# Altium schematic sheet Esp_schm.SchDoc
size A3; SheetNumber: 1; SheetTotal: 1
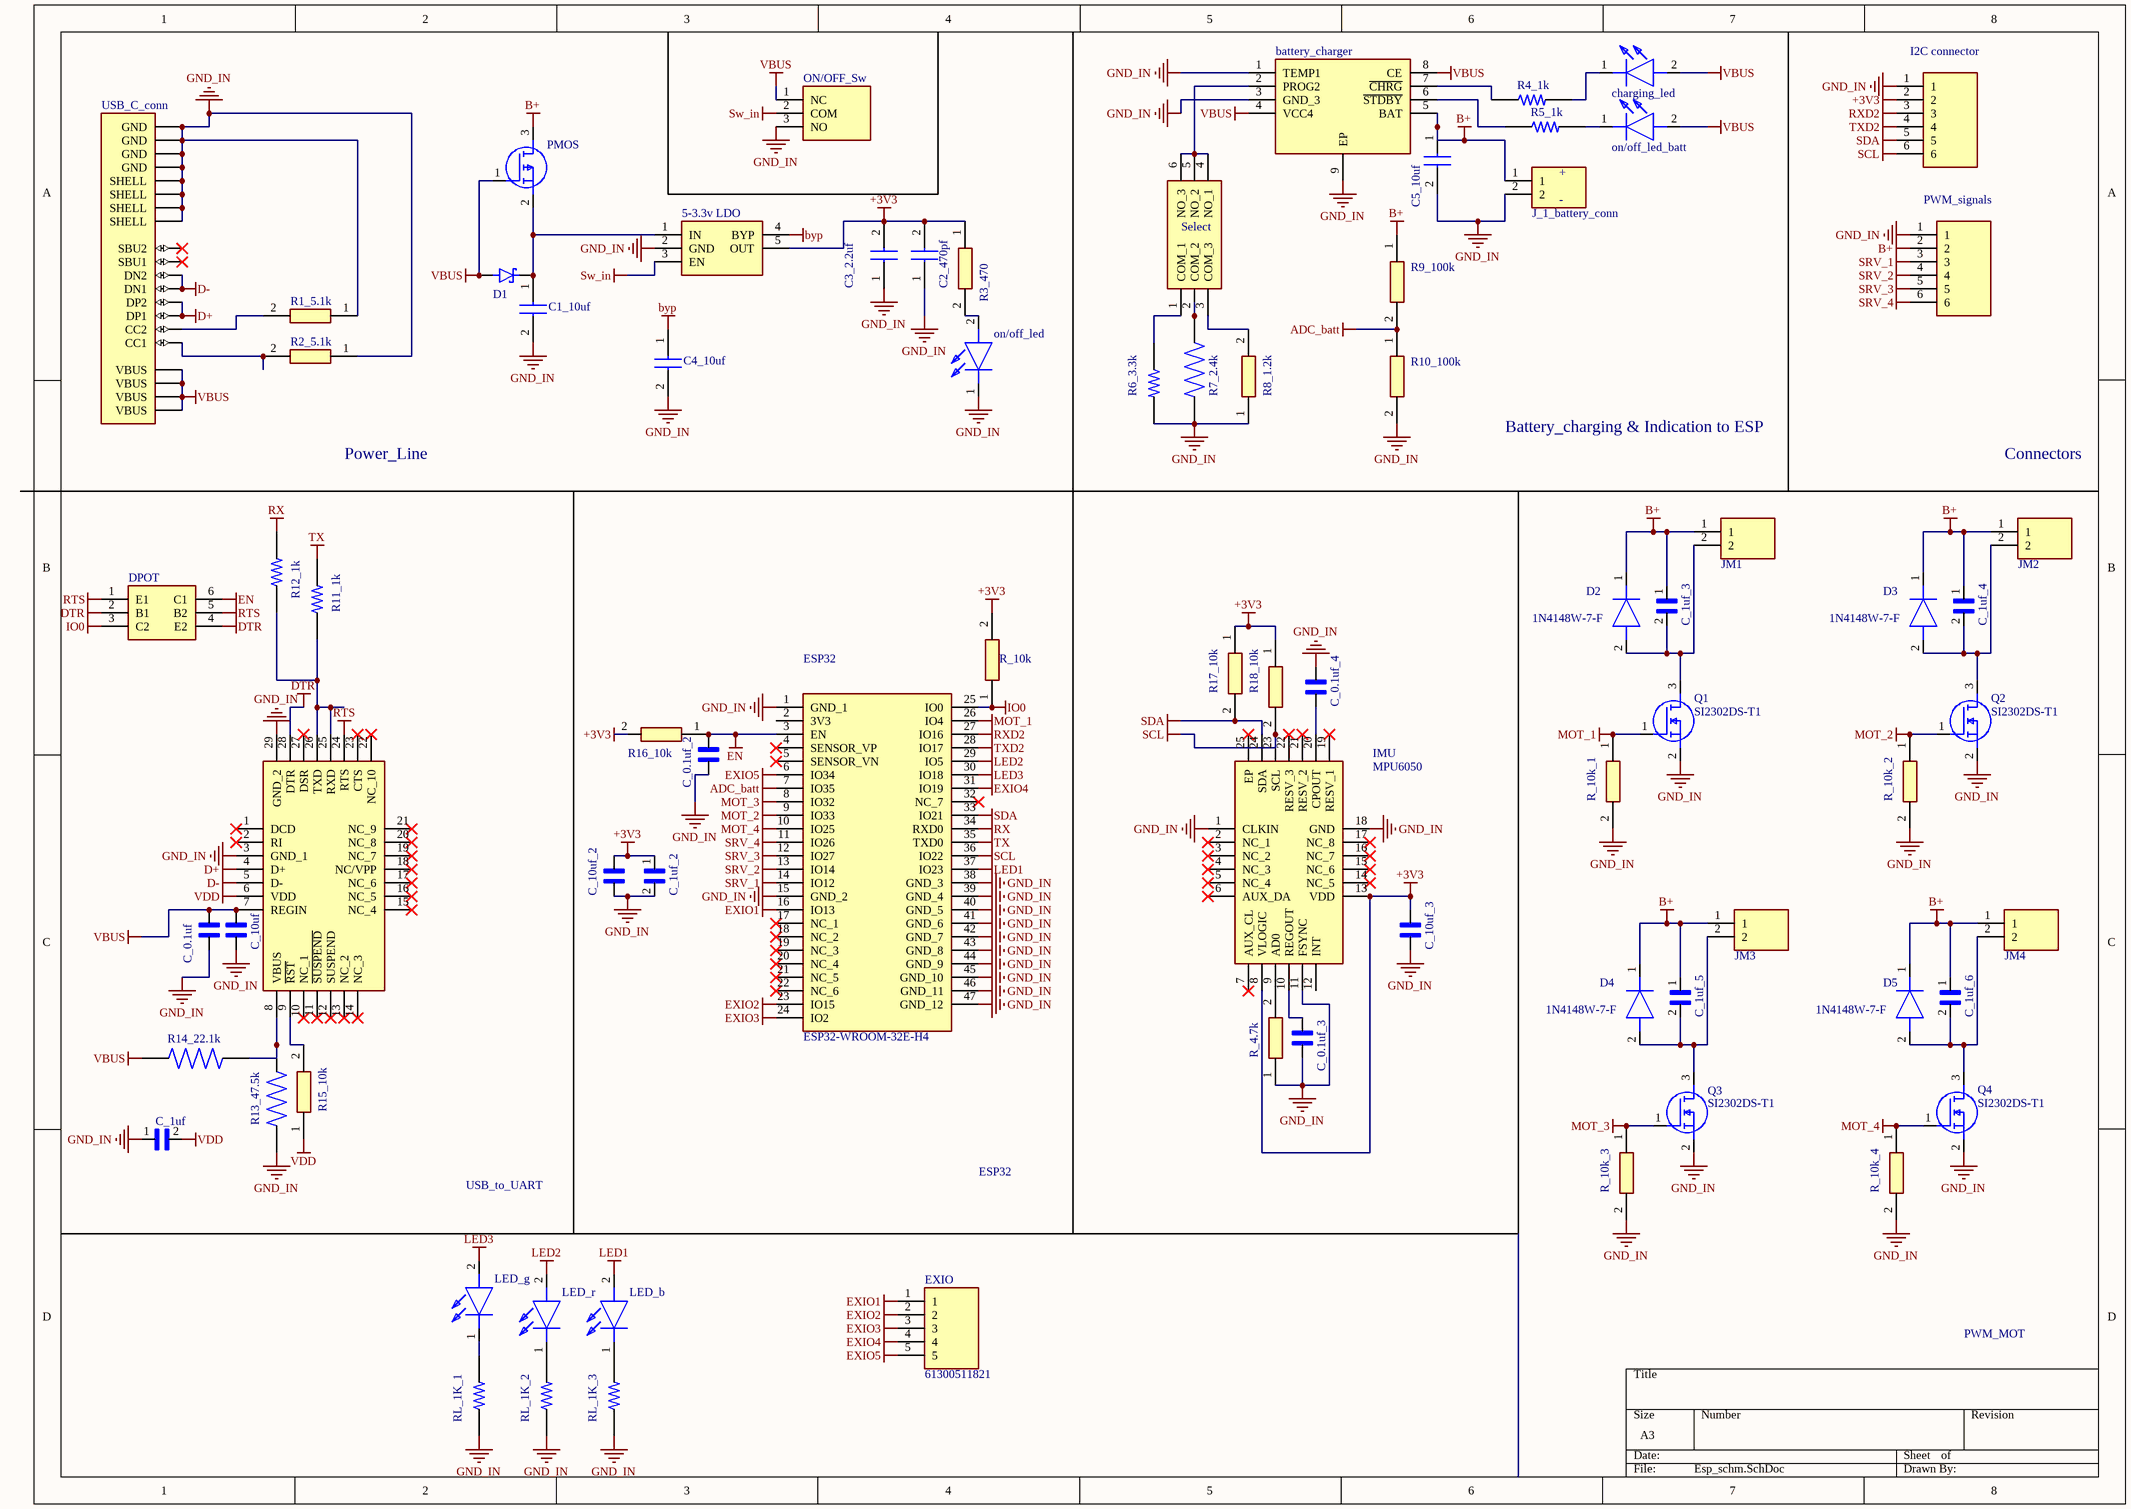
[diagram p0: Esp_schm.SchDoc]

## Parts
5-3.3v_LDO  MIC5219-3.3YM5-TR  [SOT95P280X145-5N]  (value not drawn)
battery_charger  TP4056  [SOIC127P600X175-9N]  (value not drawn)
C1_10uf  CGA3EDX7T1A106M080AU  [CAPC1608X90N]  (value not drawn)
C2_470pf  02015C471KAT2A  [CAPC0603X33N]  (value not drawn)
C3_2.2uf  CL03A225MO5C65C  [CAPC0603X35N]  (value not drawn)
C4_10uf  CGA3EDX7T1A106M080AU  [CAPC1608X90N]  (value not drawn)
C5_10uf  CGA3EDX7T1A106M080AU  [CAPC1608X90N]  (value not drawn)
C_0.1uf  GCM188R71C104KA37J  [CAPC1608X90N]  (value not drawn)
C_0.1uf_2  GCM188R71C104KA37J  [CAPC1608X90N]  (value not drawn)
C_0.1uf_3  GCM188R71C104KA37J  [CAPC1608X90N]  (value not drawn)
C_0.1uf_4  GCM188R71C104KA37J  [CAPC1608X90N]  (value not drawn)
C_1uf  C1608X7R1C105K080AC  [CAPC1608X90N]  (value not drawn)
C_1uf_2  C1608X7R1C105K080AC  [CAPC1608X90N]  (value not drawn)
C_1uf_3  C1608X7R1C105K080AC  [CAPC1608X90N]  (value not drawn)
C_1uf_4  C1608X7R1C105K080AC  [CAPC1608X90N]  (value not drawn)
C_1uf_5  C1608X7R1C105K080AC  [CAPC1608X90N]  (value not drawn)
C_1uf_6  C1608X7R1C105K080AC  [CAPC1608X90N]  (value not drawn)
C_10uf  GRT188R61C106KE13J_1  [CAPC1608X95N]  (value not drawn)
C_10uf_2  GRT188R61C106KE13J_1  [CAPC1608X95N]  (value not drawn)
C_10uf_3  GRT188R61C106KE13J_1  [CAPC1608X95N]  (value not drawn)
charging_led  SML-D12U1WT86  [LEDC1608X65N]  (value not drawn)
D1  SS34  [DIOM7959X265N]  (value not drawn)
D2  1N4148W-7-F  [1N4148W7F]
D3  1N4148W-7-F  [1N4148W7F]
D4  1N4148W-7-F  [1N4148W7F]
D5  1N4148W-7-F  [1N4148W7F]
DPOT  DDC114TU-7-F  [SOT65P210X110-6N]  (value not drawn)
ESP32  ESP32-WROOM-32E-H4  [ESP32WROOM32EH4]
EXIO  61300511821  [61300511821]
I2C_connector  B6B-XH-A_LF__SN_  [SHDR6W64P0X250_1X6_1740X575X700P]  (value not drawn)
IMU  MPU6050  [MPU6050]
J_1_battery_conn  B2B-XH-A_LF__SN_  [SHDR2W64P0X250_1X2_740X575X700P]  (value not drawn)
JM1  B2B-XH-A_LF__SN_  [SHDR2W64P0X250_1X2_740X575X700P]  (value not drawn)
JM2  B2B-XH-A_LF__SN_  [SHDR2W64P0X250_1X2_740X575X700P]  (value not drawn)
JM3  B2B-XH-A_LF__SN_  [SHDR2W64P0X250_1X2_740X575X700P]  (value not drawn)
JM4  B2B-XH-A_LF__SN_  [SHDR2W64P0X250_1X2_740X575X700P]  (value not drawn)
LED_b  150060BS55040  [LEDC1608X50N]  (value not drawn)
LED_g  ASMT-RF45-AN002  [LEDC1608X55N]  (value not drawn)
LED_r  KR_DELPS1.22-VGVI-23-H3Q4  [KRDELPS122VGVI23H3Q4]  (value not drawn)
on/off_led  LB_Q39G-L2OO-35-1  [LEDC1608X40N]  (value not drawn)
on/off_led_batt  LB_Q39G-L2OO-35-1  [LEDC1608X40N]  (value not drawn)
ON/OFF_Sw  SLW-883935-2A-D  [SLW8839352AD]  (value not drawn)
PMOS  AO3401A  [SOT95P280X125-3N]  (value not drawn)
PWM_signals  B6B-XH-A_LF__SN_  [SHDR6W64P0X250_1X6_1740X575X700P]  (value not drawn)
Q1  SI2302DS-T1  [SOT95P237X112-3N]
Q2  SI2302DS-T1  [SOT95P237X112-3N]
Q3  SI2302DS-T1  [SOT95P237X112-3N]
Q4  SI2302DS-T1  [SOT95P237X112-3N]
R1_5.1k  ERA-3VEB5101V  [ERA3KV_(0603)]  (value not drawn)
R2_5.1k  ERA-3VEB5101V  [ERA3KV_(0603)]  (value not drawn)
R3_470  ERJ-1GJF4700C  [ERJ1GJJ2R4C]  (value not drawn)
R4_1k  RC0603FR-071KL  [RESC1607X60N]  (value not drawn)
R5_1k  RC0603FR-071KL  [RESC1607X60N]  (value not drawn)
R6_3.3k  RC0603FR-073K3L  [RESC1607X60N]  (value not drawn)
R7_2.4k  RC0603FR-072K4L  [RESC1607X60N]  (value not drawn)
R8_1.2k  ERJ-3GEYJ122V  [ERJ3EKF1000V]  (value not drawn)
R9_100k  RC0805FR-7W100KL  [RESC2012X60N]  (value not drawn)
R10_100k  RC0805FR-7W100KL  [RESC2012X60N]  (value not drawn)
R11_1k  RC0603FR-071KL  [RESC1607X60N]  (value not drawn)
R12_1k  RC0603FR-071KL  [RESC1607X60N]  (value not drawn)
R13_47.5k  CRCW060347K5FKEA  [RESC1508X50N]  (value not drawn)
R14_22.1k  CRCW060322K1FKEA  [RESC1508X50N]  (value not drawn)
R15_10k  CRCW060310K0FKEA  [RESC1608X50N]  (value not drawn)
R16_10k  CRCW060310K0FKEA  [RESC1608X50N]  (value not drawn)
R17_10k  CRCW060310K0FKEA  [RESC1608X50N]  (value not drawn)
R18_10k  CRCW060310K0FKEA  [RESC1608X50N]  (value not drawn)
R_4.7k  GWCR0603-4K7FT5  [RESC1608X55N]  (value not drawn)
R_10k  CRCW060310K0FKEA  [RESC1608X50N]  (value not drawn)
R_10k_1  CRCW060310K0FKEA  [RESC1608X50N]  (value not drawn)
R_10k_2  CRCW060310K0FKEA  [RESC1608X50N]  (value not drawn)
R_10k_3  CRCW060310K0FKEA  [RESC1608X50N]  (value not drawn)
R_10k_4  CRCW060310K0FKEA  [RESC1608X50N]  (value not drawn)
RL_1K_1  RC0603FR-071KL  [RESC1607X60N]  (value not drawn)
RL_1K_2  RC0603FR-071KL  [RESC1607X60N]  (value not drawn)
RL_1K_3  RC0603FR-071KL  [RESC1607X60N]  (value not drawn)
Select  DS01-254-S-03BE  [DS01254S03BE]  (value not drawn)
USB_C_conn  USB4085-GF-A_REVB  [GCT_USB4085-GF-A_REVB]  (value not drawn)
USB_to_UART  CP2102-GM  [QFN50P500X500X100-29N-D]  (value not drawn)

## Nets
+3V3: 5-3.3v_LDO.5(OUT) C2_470pf.2 C3_2.2uf.2 C_1uf_2.1 C_10uf_2.2 C_10uf_3.2 I2C_connector.2 IMU.8(VLOGIC) IMU.13(VDD) R3_470.1 R16_10k.2 R17_10k.1 R18_10k.1 R_10k.2
ADC_batt: ESP32.7(IO35) R9_100k.2 R10_100k.1
B+: battery_charger.5(BAT) C5_10uf.1 C_1uf_3.1 C_1uf_4.1 C_1uf_5.1 C_1uf_6.1 D2.1(K) D3.1(K) D4.1(K) D5.1(K) J_1_battery_conn.1 JM1.1 JM2.1 JM3.1 JM4.1 PMOS.3(D) PWM_signals.2 R9_100k.1
byp: 5-3.3v_LDO.4(BYP) C4_10uf.1
D+: USB_C_conn.A6(DP1) USB_C_conn.B6(DP2) USB_to_UART.4(D+)
D-: USB_C_conn.A7(DN1) USB_C_conn.B7(DN2) USB_to_UART.5(D-)
DTR: DPOT.2(B1) DPOT.4(E2) USB_to_UART.28(DTR)
EN: C_0.1uf_2.2 DPOT.6(C1) ESP32.3(EN) R16_10k.1
EXIO1: ESP32.16(IO13) EXIO.1
EXIO2: ESP32.23(IO15) EXIO.2
EXIO3: ESP32.24(IO2) EXIO.3
EXIO4: ESP32.31(IO19) EXIO.4
EXIO5: ESP32.6(IO34) EXIO.5
GND_IN: 5-3.3v_LDO.2(GND) battery_charger.1(TEMP1) battery_charger.3(GND_3) battery_charger.9(EP) C1_10uf.2 C2_470pf.1 C3_2.2uf.1 C4_10uf.2 C5_10uf.2 C_0.1uf.1 C_0.1uf_2.1 C_0.1uf_3.1 C_0.1uf_4.2 C_1uf.1 C_1uf_2.2 C_10uf.1 C_10uf_2.1 C_10uf_3.1 ESP32.1(GND_1) ESP32.15(GND_2) ESP32.38(GND_3) ESP32.39(GND_4) ESP32.40(GND_5) ESP32.41(GND_6) ESP32.42(GND_7) ESP32.43(GND_8) ESP32.44(GND_9) ESP32.45(GND_10) ESP32.46(GND_11) ESP32.47(GND_12) I2C_connector.1 IMU.1(CLKIN) IMU.11(FSYNC) IMU.18(GND) J_1_battery_conn.2 on/off_led.1(K) ON/OFF_Sw.3(NO) PWM_signals.1 Q1.2(S) Q2.2(S) Q3.2(S) Q4.2(S) R1_5.1k.1 R2_5.1k.1 R6_3.3k.2 R7_2.4k.1 R8_1.2k.1 R10_100k.2 R13_47.5k.1 R_4.7k.1 R_10k_1.2 R_10k_2.2 R_10k_3.2 R_10k_4.2 RL_1K_1.1 RL_1K_2.1 RL_1K_3.1 USB_C_conn.A1(GND) USB_C_conn.A12(GND) USB_C_conn.B1(GND) USB_C_conn.B12(GND) USB_C_conn.S1(SHELL) USB_C_conn.S2(SHELL) USB_C_conn.S3(SHELL) USB_C_conn.S4(SHELL) USB_to_UART.3(GND_1) USB_to_UART.29(GND_2)
IO0: DPOT.3(C2) ESP32.25(IO0) R_10k.1
LED1: ESP32.37(IO23) LED_b.2(A)
LED2: ESP32.29(IO5) LED_r.2(A)
LED3: ESP32.30(IO18) LED_g.2(A)
MOT_1: ESP32.26(IO4) Q1.1(G) R_10k_1.1
MOT_2: ESP32.9(IO33) Q2.1(G) R_10k_2.1
MOT_3: ESP32.8(IO32) Q3.1(G) R_10k_3.1
MOT_4: ESP32.10(IO25) Q4.1(G) R_10k_4.1
RTS: DPOT.1(E1) DPOT.5(B2) USB_to_UART.24(RTS)
RX: ESP32.34(RXD0) R12_1k.2
RXD2: ESP32.27(IO16) I2C_connector.3
SCL: ESP32.36(IO22) I2C_connector.6 IMU.23(SCL) R18_10k.2
SDA: ESP32.33(IO21) I2C_connector.5 IMU.24(SDA) R17_10k.2
SRV_1: ESP32.14(IO12) PWM_signals.3
SRV_2: ESP32.13(IO14) PWM_signals.4
SRV_3: ESP32.12(IO27) PWM_signals.5
SRV_4: ESP32.11(IO26) PWM_signals.6
Sw_in: 5-3.3v_LDO.3(EN) ON/OFF_Sw.2(COM)
TX: ESP32.35(TXD0) R11_1k.2
TXD2: ESP32.28(IO17) I2C_connector.4
VBUS: battery_charger.4(VCC4) battery_charger.8(CE) C_0.1uf.2 C_10uf.2 charging_led.2(A) D1.A on/off_led_batt.2(A) ON/OFF_Sw.1(NC) PMOS.1(G) R14_22.1k.1 USB_C_conn.A4(VBUS) USB_C_conn.A9(VBUS) USB_C_conn.B4(VBUS) USB_C_conn.B9(VBUS) USB_to_UART.7(REGIN)
VDD: C_1uf.2 R15_10k.1 USB_to_UART.6(VDD)
Net5-3.3v_LDO_1: 5-3.3v_LDO.1(IN) C1_10uf.1 D1.C(K) PMOS.2(S)
Netbattery_charger_2: battery_charger.2(PROG2) Select.4(NO_1) Select.5(NO_2) Select.6(NO_3)
Netbattery_charger_6: battery_charger.6(~{STDBY}) R5_1k.1
Netbattery_charger_7: battery_charger.7(~{CHRG}) R4_1k.1
NetC_0.1uf_3_2: C_0.1uf_3.2 IMU.10(REGOUT)
NetC_0.1uf_4_1: C_0.1uf_4.1 IMU.20(CPOUT)
NetC_1uf_3_2: C_1uf_3.2 D2.2(A) JM1.2 Q1.3(D)
NetC_1uf_4_2: C_1uf_4.2 D3.2(A) JM2.2 Q2.3(D)
NetC_1uf_5_2: C_1uf_5.2 D4.2(A) JM3.2 Q3.3(D)
NetC_1uf_6_2: C_1uf_6.2 D5.2(A) JM4.2 Q4.3(D)
Netcharging_led_1: charging_led.1(K) R4_1k.2
NetIMU_9: IMU.9(AD0) R_4.7k.2
NetLED_b_1: LED_b.1(K) RL_1K_3.2
NetLED_g_1: LED_g.1(K) RL_1K_1.2
NetLED_r_1: LED_r.1(K) RL_1K_2.2
Neton/off_led_2: on/off_led.2(A) R3_470.2
Neton/off_led_batt_1: on/off_led_batt.1(K) R5_1k.2
NetR1_5.1k_2: R1_5.1k.2 USB_C_conn.B5(CC2)
NetR2_5.1k_2: R2_5.1k.2 USB_C_conn.A5(CC1)
NetR6_3.3k_1: R6_3.3k.1 Select.1(COM_1)
NetR7_2.4k_2: R7_2.4k.2 Select.2(COM_2)
NetR8_1.2k_2: R8_1.2k.2 Select.3(COM_3)
NetR11_1k_1: R11_1k.1 R12_1k.1 USB_to_UART.25(RXD) USB_to_UART.26(TXD)
NetR13_47.5k_2: R13_47.5k.2 R14_22.1k.2 USB_to_UART.8(VBUS)
NetR15_10k_2: R15_10k.2 USB_to_UART.9(~{RST})

Not connected (* = marked no-connect by the designer): ESP32 2(3V3) 4(SENSOR_VP)* 5(SENSOR_VN)* 17(NC_1)* 18(NC_2)* 19(NC_3)* 20(NC_4)* 21(NC_5)* 22(NC_6)* 32(NC_7)*; IMU 2(NC_1)* 3(NC_2)* 4(NC_3)* 5(NC_4)* 6(AUX_DA)* 7(AUX_CL)* 12(INT) 14(NC_5)* 15(NC_6)* 16(NC_7)* 17(NC_8)* 19(RESV_1)* 21(RESV_2)* 22(RESV_3)* 25(EP)*; USB_C_conn A8(SBU1)* B8(SBU2)*; USB_to_UART 1(DCD)* 2(RI)* 10(NC_1)* 11(~{SUSPEND})* 12(SUSPEND)* 13(NC_2)* 14(NC_3)* 15(NC_4)* 16(NC_5)* 17(NC_6)* 18(NC/VPP)* 19(NC_7)* 20(NC_8)* 21(NC_9)* 22(NC_10)* 23(CTS)* 27(DSR)*

## Notes on the sheet
- +
- (near J_1_battery_conn) -
- Battery_charging & Indication to ESP
- Power_Line
- Connectors
- ESP32
- PWM_MOT

## Library data of the parts
5-3.3v_LDO = MIC5219-3.3YM5-TR: Integrated Circuit; Manufacturer_Name: Microchip; Datasheet Link: http://www.microchip.com/mymicrochip/filehandler.aspx?ddocname=en579712; Height: 1.45mm; Manufacturer_Part_Number: MIC5219-3.3YM5-TR; Mouser Part Number: 998-MIC5219-3.3YM5TR; Mouser Price/Stock: https://www.mouser.co.uk/ProductDetail/Microchip-Technology/MIC5219-3.3YM5-TR?qs=U6T8BxXiZAWojkIJMtSJlw%3D%3D; Arrow Part Number: MIC5219-3.3YM5-TR; Arrow Price/Stock: https://www.arrow.com/en/products/mic5219-3.3ym5-tr/microchip-technology?region=europe
battery_charger = TP4056: Connector; Manufacturer_Name: NanJing Top Power; Datasheet Link: https://dlnmh9ip6v2uc.cloudfront.net/datasheets/Prototyping/TP4056.pdf; Height: 1.75mm; Manufacturer_Part_Number: TP4056
C1_10uf C4_10uf C5_10uf = CGA3EDX7T1A106M080AU: Capacitor; Manufacturer_Name: TDK; Datasheet Link: https://product.tdk.com/system/files/dam/doc/product/capacitor/ceramic/mlcc/catalog/mlcc_automotive_general_en.pdf; Height: 0.9mm; Manufacturer_Part_Number: CGA3EDX7T1A106M080AU; Mouser Part Number: 810-CGA3EDX7T1A106M0; Mouser Price/Stock: https://www.mouser.co.uk/ProductDetail/TDK/CGA3EDX7T1A106M080AU?qs=ZcfC38r4PovL%2FBNBUzzBFw%3D%3D
C2_470pf = 02015C471KAT2A: Capacitor; Manufacturer_Name: Kyocera AVX; Datasheet Link: http://www.mouser.com/catalog/supplier/library/pdf/AVXSurfaceMountCeramic.pdf; Height: 0.33mm; Manufacturer_Part_Number: 02015C471KAT2A; Mouser Part Number: 581-02015C471KAT2A; Mouser Price/Stock: https://www.mouser.co.uk/ProductDetail/AVX/02015C471KAT2A?qs=k4kUdCzLgS7rjnclwGOjsA%3D%3D
C3_2.2uf = CL03A225MO5C65C: Capacitor; Manufacturer_Name: SAMSUNG; Datasheet Link: https://www.samsungsem.com/resources/file/global/support/product_catalog/MLCC.pdf; Height: 0.35mm; Manufacturer_Part_Number: CL03A225MO5C65C; Mouser Part Number: 187-CL03A225MO5C65C; Mouser Price/Stock: https://www.mouser.co.uk/ProductDetail/Samsung-Electro-Mechanics/CL03A225MO5C65C?qs=i8QVZAFTkqSietvJWGyvXw%3D%3D
C_0.1uf C_0.1uf_2-C_0.1uf_4 = GCM188R71C104KA37J: SMD Capacitor X7R(EIA) with Capacitance: 0.10uF Tol. 10%. Rated Voltage: 16Vdc; MF: Murata; SnapEDA_Link: https://www.snapeda.com/parts/GCM188R71C104KA37J/Murata/view-part/?ref=snap; Package: 1608 Murata; Value: *; MP: GCM188R71C104KA37J; Check_prices: https://www.snapeda.com/parts/GCM188R71C104KA37J/Murata/view-part/?ref=eda
C_1uf C_1uf_2-C_1uf_6 = C1608X7R1C105K080AC: 1ÂµF Â±10% 16V Ceramic Capacitor X7R 0603 (1608 Metric); MF: TDK; SnapEDA_Link: https://www.snapeda.com/parts/C1608X7R1C105K080AC/TDK-Lambda+Americas+Inc/view-part/?ref=snap; MP: C1608X7R1C105K080AC; Check_prices: https://www.snapeda.com/parts/C1608X7R1C105K080AC/TDK-Lambda+Americas+Inc/view-part/?ref=eda; Price: None; Value: *; Availability: In Stock; Package: 1608 TDK; Purchase-URL: https://pricing.snapeda.com/search/part/C1608X7R1C105K080AC/?ref=eda
C_10uf C_10uf_2 C_10uf_3 = GRT188R61C106KE13J_1: SMD capacitor X5R(EIA) with capacitance 10uF Tol.10%. Rated voltage 16Vdc 85C; MF: Murata; SnapEDA_Link: https://www.snapeda.com/parts/GRT188R61C106KE13J/Murata/view-part/?ref=snap; Package: 1608 Murata; Value: *; MP: GRT188R61C106KE13J; Check_prices: https://www.snapeda.com/parts/GRT188R61C106KE13J/Murata/view-part/?ref=eda
charging_led = SML-D12U1WT86: LED; Manufacturer_Name: ROHM Semiconductor; Datasheet Link: https://componentsearchengine.com/Datasheets/1/SML-D12U1WT86.pdf; Height: 0.65mm; Manufacturer_Part_Number: SML-D12U1WT86; Mouser Part Number: 755-SML-D12U1WT86; Mouser Price/Stock: https://www.mouser.co.uk/ProductDetail/ROHM-Semiconductor/SML-D12U1WT86?qs=M3jcYzEJUdEySuGkbjHEtQ%3D%3D
D1 = SS34: Diode Schottky 40 V 3A Surface Mount SMC (DO-214AB); MF: onsemi; SnapEDA_Link: https://www.snapeda.com/parts/SS34/Onsemi/view-part/?ref=snap; Package: SMC-2 ON Semiconductor; Value: *; MP: SS34; Check_prices: https://www.snapeda.com/parts/SS34/Onsemi/view-part/?ref=eda
D2-D5 = 1N4148W-7-F: Diode; Manufacturer_Name: Multicomp Pro; Datasheet Link: http://www.farnell.com/datasheets/2861325.pdf; Height: 1.25mm; Manufacturer_Part_Number: 1N4148W-7-F
DPOT = DDC114TU-7-F: Transistor BJT NPN; Manufacturer_Name: Diodes Incorporated; Datasheet Link: https://www.diodes.com//assets/Datasheets/DDC_XXXX_U.pdf; Height: 1.1mm; Manufacturer_Part_Number: DDC114TU-7-F; Mouser Part Number: 621-DDC114TU-F; Mouser Price/Stock: https://www.mouser.co.uk/ProductDetail/Diodes-Incorporated/DDC114TU-7-F?qs=kw05dxSAXz1KFBQK0OZaZg%3D%3D; Arrow Part Number: DDC114TU-7-F; Arrow Price/Stock: https://www.arrow.com/en/products/ddc114tu-7-f/diodes-incorporated?utm_currency=USD&region=nac
ESP32 = ESP32-WROOM-32E-H4: Integrated Circuit; Manufacturer_Name: Espressif Systems; Datasheet Link: https://www.espressif.com/sites/default/files/documentation/esp32-wroom-32e_esp32-wroom-32ue_datasheet_en.pdf; Height: 3.25mm; Manufacturer_Part_Number: ESP32-WROOM-32E-H4; Mouser Part Number: 356-ESP32WRM320EH3PS; Mouser Price/Stock: https://www.mouser.co.uk/ProductDetail/Espressif-Systems/ESP32-WROOM-32E-H4?qs=Li%252BoUPsLEnuUxeqGSCz%252BcA%3D%3D
EXIO = 61300511821: Connector; Manufacturer_Name: Wurth Elektronik; Datasheet Link: https://www.we-online.com/catalog/datasheet/61300511821.pdf; Height: 8.65mm; Manufacturer_Part_Number: 61300511821; Mouser Part Number: 710-61300511821; Mouser Price/Stock: https://www.mouser.co.uk/ProductDetail/Wurth-Elektronik/61300511821?qs=iLbezkQI%252BsjtLywwvTh3KA%3D%3D
I2C_connector PWM_signals = B6B-XH-A_LF__SN_: Connector; Manufacturer_Name: JST (JAPAN SOLDERLESS TERMINALS); Manufacturer_Part_Number: B6B-XH-A(LF)(SN); Datasheet Link: https://datasheet.lcsc.com/szlcsc/JST-Sales-America-B6B-XH-A-LF-SN_C144397.pdf; Height: 7mm; Mouser Part Number: 306-B6BXHALFSN; Mouser Price/Stock: https://www.mouser.co.uk/ProductDetail/JST-Commercial/B6B-XH-ALFSN?qs=cdbOS8ANM9AKmMmofXbwlw%3D%3D; Arrow Part Number: B6B-XH-A(LF)(SN); Arrow Price/Stock: https://www.arrow.com/en/products/b6b-xh-a-lf-sn/jst-manufacturing?utm_currency=USD&region=europe
IMU = MPU6050: Integrated Circuit; Manufacturer_Name: TDK; Datasheet Link: https://invensense.tdk.com/wp-content/uploads/2015/02/MPU-6000-Datasheet1.pdf; Height: 0.95mm; Manufacturer_Part_Number: MPU6050
J_1_battery_conn JM1-JM4 = B2B-XH-A_LF__SN_: Connector; Manufacturer_Name: JST (JAPAN SOLDERLESS TERMINALS); Manufacturer_Part_Number: B2B-XH-A(LF)(SN); Datasheet Link: http://www.jst-mfg.com/product/pdf/eng/eXH.pdf; Height: 7mm; Mouser Part Number: 306-B2BXHALFSNP; Mouser Price/Stock: https://www.mouser.co.uk/ProductDetail/JST-Commercial/B2B-XH-ALFSN?qs=cdbOS8ANM9DdcSn9qRmfCw%3D%3D; Arrow Part Number: B2B-XH-A(LF)(SN); Arrow Price/Stock: https://www.arrow.com/en/products/b2b-xh-a-lf-sn/jst-manufacturing?utm_currency=USD&region=europe
LED_b = 150060BS55040: LED; Manufacturer_Name: Wurth Elektronik; Datasheet Link: https://www.we-online.com/catalog/datasheet/150060BS55040.pdf; Height: 0.5mm; Manufacturer_Part_Number: 150060BS55040; Mouser Part Number: 710-150060BS55040; Mouser Price/Stock: https://www.mouser.co.uk/ProductDetail/Wurth-Elektronik/150060BS55040?qs=fAHHVMwC%252BbiEgEQkEQqtiA%3D%3D
LED_g = ASMT-RF45-AN002: LED; Manufacturer_Name: Avago Technologies; Datasheet Link: https://datasheet.datasheetarchive.com/originals/distributors/SFDatasheet-4/sf-00083833.pdf; Height: 0.55mm; Manufacturer_Part_Number: ASMT-RF45-AN002; Mouser Part Number: 630-ASMT-RF45-AN002; Mouser Price/Stock: https://www.mouser.co.uk/ProductDetail/Broadcom-Avago/ASMT-RF45-AN002?qs=7zQgkplsu%2FPO8CkxOLjU7Q%3D%3D
LED_r = KR_DELPS1.22-VGVI-23-H3Q4: LED; Manufacturer_Name: ams OSRAM; Manufacturer_Part_Number: KR DELPS1.22-VGVI-23-H3Q4; Datasheet Link: https://look.ams-osram.com/m/71cad974eca389fc/original/KR-DELPS1-22.pdf; Height: 0.7mm; Mouser Part Number: 720-KRDELPS122VGVI3H; Mouser Price/Stock: https://www.mouser.co.uk/ProductDetail/ams-OSRAM/KR-DELPS1.22-VGVI-23-H3Q4?qs=vvQtp7zwQdMjUadvrCUF1Q%3D%3D
on/off_led on/off_led_batt = LB_Q39G-L2OO-35-1: LED; Manufacturer_Name: ams OSRAM; Manufacturer_Part_Number: LB Q39G-L2OO-35-1; Datasheet Link: http://www.mouser.com/ds/2/311/LBQ39G-CHIPLED0603-553388.pdf; Height: 0.4mm; Mouser Part Number: 720-LBQ39GL2N2351; Mouser Price/Stock: https://www.mouser.co.uk/ProductDetail/ams-OSRAM/LB-Q39G-L2OO-35-1?qs=74fRo9GAWsxvZBH6a5xY%252BA%3D%3D; Arrow Part Number: LB Q39G-L2OO-35-1; Arrow Price/Stock: https://www.arrow.com/en/products/lbq39g-l2oo-35-1/osram-opto-semiconductors
ON/OFF_Sw = SLW-883935-2A-D: Switch; Manufacturer_Name: Same Sky; Datasheet Link: https://www.sameskydevices.com/product/resource/supplyframepdf/slw-883935-2a-d.pdf; Height: 6.1mm; Manufacturer_Part_Number: SLW-883935-2A-D; Mouser Part Number: 179-SLW-883935-2A-D; Mouser Price/Stock: https://www.mouser.co.uk/ProductDetail/Same-Sky/SLW-883935-2A-D?qs=1Kr7Jg1SGW%2Fv9j8ky6fn%2FQ%3D%3D; Arrow Part Number: SLW-883935-2A-D; Arrow Price/Stock: https://www.arrow.com/en/products/slw-883935-2a-d/cui-devices?utm_currency=USD&region=nac
PMOS = AO3401A: MOSFET (P-Channel); Manufacturer_Name: Alpha & Omega Semiconductors; Datasheet Link: http://www.aosmd.com/pdfs/datasheet/AO3401A.pdf; Height: 1.25mm; Manufacturer_Part_Number: AO3401A; Arrow Part Number: AO3401A; Arrow Price/Stock: https://www.arrow.com/en/products/ao3401a/alpha-and-omega-semiconductor?utm_currency=USD&region=nac
Q1-Q4 = SI2302DS-T1: MOSFET (N-Channel); Manufacturer_Name: Vishay; Datasheet Link: https://4donline.ihs.com/images/VipMasterIC/IC/SILX/SILXS08192/SILXS08192-1.pdf?hkey=EF798316E3902B6ED9A73243A3159BB0; Height: 1.12mm; Manufacturer_Part_Number: SI2302DS-T1; Mouser Part Number: 781-SI2302DS; Mouser Price/Stock: https://www.mouser.co.uk/ProductDetail/Vishay-Siliconix/SI2302DS-T1?qs=Vtbibb3IBkf5ybaLingfiw%3D%3D
R1_5.1k R2_5.1k = ERA-3VEB5101V: Resistor; Manufacturer_Name: Panasonic; Datasheet Link: http://industrial.panasonic.com/cdbs/www-data/pdf/RDM0000/RDM0000C331.pdf; Height: 0.4mm; Manufacturer_Part_Number: ERA-3VEB5101V; Mouser Part Number: 667-ERA-3VEB5101V; Mouser Price/Stock: https://www.mouser.co.uk/ProductDetail/Panasonic/ERA-3VEB5101V?qs=OlC7AqGiEDl9tf8gy86hUQ%3D%3D
R3_470 = ERJ-1GJF4700C: Resistor; Manufacturer_Name: Panasonic; Datasheet Link: https://industrial.panasonic.com/cdbs/www-data/pdf/RDA0000/AOA0000C304.pdf; Height: 0.26mm; Manufacturer_Part_Number: ERJ-1GJF4700C; Mouser Part Number: 667-ERJ-1GJF4700C; Mouser Price/Stock: https://www.mouser.co.uk/ProductDetail/Panasonic/ERJ-1GJF4700C?qs=OcgtsXO%252B3gu9AFcFTiiiHQ%3D%3D
R4_1k R5_1k R11_1k R12_1k RL_1K_1-RL_1K_3 = RC0603FR-071KL: 1 kOhms Â±1% 0.1W, 1/10W Chip Resistor 0603 (1608 Metric) Moisture Resistant Thick Film; MF: Yageo; SnapEDA_Link: https://www.snapeda.com/parts/RC0603FR-071KL/Yageo/view-part/?ref=snap; Package: 0603 Yageo; Value: *; MP: RC0603FR-071KL; Check_prices: https://www.snapeda.com/parts/RC0603FR-071KL/Yageo/view-part/?ref=eda
R6_3.3k = RC0603FR-073K3L: 3.3 kOhms ±1% 0.1W, 1/10W Chip Resistor 0603 (1608 Metric) Moisture Resistant Thick Film; MF: Yageo; SnapEDA_Link: https://www.snapeda.com/parts/RC0603FR-073K3L/Yageo/view-part/?ref=snap; Package: 0603 Yageo; Value: *; MP: RC0603FR-073K3L; Check_prices: https://www.snapeda.com/parts/RC0603FR-073K3L/Yageo/view-part/?ref=eda
R7_2.4k = RC0603FR-072K4L: 2.4 kOhms Â±1% 0.1W, 1/10W Chip Resistor 0603 (1608 Metric) Moisture Resistant Thick Film; MF: Yageo; SnapEDA_Link: https://www.snapeda.com/parts/RC0603FR-072K4L/Yageo/view-part/?ref=snap; Package: 0603 Yageo; Value: *; MP: RC0603FR-072K4L; Check_prices: https://www.snapeda.com/parts/RC0603FR-072K4L/Yageo/view-part/?ref=eda
R8_1.2k = ERJ-3GEYJ122V: Resistor; Manufacturer_Name: Panasonic; Datasheet Link: http://docs-europe.electrocomponents.com/webdocs/13ba/0900766b813ba21b.pdf; Height: 0.55mm; Manufacturer_Part_Number: ERJ-3GEYJ122V; Mouser Part Number: 667-ERJ-3GEYJ122V; Mouser Price/Stock: http://www.mouser.com/Search/ProductDetail.aspx?qs=66DK8nO8gJD4IDjQwkcMjA%3d%3d; Arrow Part Number: ERJ-3GEYJ122V; Arrow Price/Stock: https://www.arrow.com/en/products/erj-3geyj122v/panasonic?region=europe
R9_100k R10_100k = RC0805FR-7W100KL: Resistor; Manufacturer_Name: KEMET; Datasheet Link: http://www.yageo.com/documents/recent/PYu-RC_Group_51_RoHS_L_10.pdf; Height: 0.6mm; Manufacturer_Part_Number: RC0805FR-7W100KL; Mouser Part Number: 603-RC0805FR-7W100KL; Mouser Price/Stock: https://www.mouser.co.uk/ProductDetail/Yageo/RC0805FR-7W100KL?qs=tggtontpCXPWF1UQCat0Yw%3D%3D
R13_47.5k = CRCW060347K5FKEA: Resistor;Thick Film;47.5 Kilohms;0.1 W;1%;SMT;0603;TCR 37 ppm/DegC;Tape and Reel | Vishay Dale CRCW060347K5FKEA; SnapEDA_Link: https://www.snapeda.com/parts/CRCW060347K5FKEA/Vishay/view-part/?ref=snap; Package: 1508 Vishay; Value: *; MF: Vishay; MP: CRCW060347K5FKEA; Check_prices: https://www.snapeda.com/parts/CRCW060347K5FKEA/Vishay/view-part/?ref=eda
R14_22.1k = CRCW060322K1FKEA: Resistor,Thick Film,22.1 Kilohms,0.1 W,1%,SMT,0603,TCR 37 ppm/DegC,Cut Tape | Vishay Dale CRCW060322K1FKEA; SnapEDA_Link: https://www.snapeda.com/parts/CRCW060322K1FKEA/Vishay+Dale/view-part/?ref=snap; Package: 1508 Vishay; Value: *; MF: Vishay Dale; MP: CRCW060322K1FKEA; Check_prices: https://www.snapeda.com/parts/CRCW060322K1FKEA/Vishay+Dale/view-part/?ref=eda
R15_10k R16_10k R17_10k R18_10k R_10k R_10k_1-R_10k_4 = CRCW060310K0FKEA: Resistor; Manufacturer_Name: Vishay; Datasheet Link: http://www.vishay.com/docs/20035/dcrcwe3.pdf; Height: 0.5mm; Manufacturer_Part_Number: CRCW060310K0FKEA; Mouser Part Number: 71-CRCW0603-10K-E3; Mouser Price/Stock: https://www.mouser.co.uk/ProductDetail/Vishay-Dale/CRCW060310K0FKEA?qs=pAO1Z172M84BVnhDjtnsoQ%3D%3D; Arrow Part Number: CRCW060310K0FKEA; Arrow Price/Stock: https://www.arrow.com/en/products/crcw060310k0fkea/vishay?region=nac
R_4.7k = GWCR0603-4K7FT5: Resistor; Manufacturer_Name: TT Electronics; Datasheet Link: https://www.mouser.co.uk/datasheet/2/414/GWCR-1528385.pdf; Height: 0.55mm; Manufacturer_Part_Number: GWCR0603-4K7FT5; Mouser Part Number: 756-GWCR0603-4K7FT5; Mouser Price/Stock: https://www.mouser.co.uk/ProductDetail/Welwyn-Components-TT-Electronics/GWCR0603-4K7FT5?qs=EU6FO9ffTweXCi9%252Ba9OJ9g%3D%3D
Select = DS01-254-S-03BE: Switch; Manufacturer_Name: Same Sky; Datasheet Link: https://www.sameskydevices.com/product/resource/supplyframepdf/ds01-254.pdf; Height: 7mm; Manufacturer_Part_Number: DS01-254-S-03BE; Mouser Part Number: 490-DS01-254-S-03BE; Mouser Price/Stock: https://www.mouser.co.uk/ProductDetail/Same-Sky/DS01-254-S-03BE?qs=wnTfsH77Xs5VL0Hs2OQIYw%3D%3D; Arrow Part Number: DS01-254-S-03BE; Arrow Price/Stock: https://www.arrow.com/en/products/ds01-254-s-03be/cui-devices?region=nac
USB_C_conn = USB4085-GF-A_REVB: USB-C (USB TYPE-C) USB 2.0 æ’åº§è¿žæŽ¥å™¨ 24 (16+8 Dummy) ä½é€šå­”ã€ç›´è§’ã€ä½Žæˆæœ¬ã€3.46mm å¤–å½¢ã€16 é’ˆã€æ°´å¹³ã€é¡¶éƒ¨å®‰è£…; MF: Global Connector Technology; SnapEDA_Link: https://www.snapeda.com/parts/USB4085-GF-A/Global+Connector+Technology/view-part/?ref=snap; Package: None; Value: *; MP: USB4085-GF-A; Check_prices: https://www.snapeda.com/parts/USB4085-GF-A/Global+Connector+Technology/view-part/?ref=eda
USB_to_UART = CP2102-GM: Integrated Circuit; Manufacturer_Name: Silicon Labs; Datasheet Link: https://datasheet.datasheetarchive.com/originals/distributors/Datasheets_SAMA/e8061a629457dcd57bb8c8d46a00fbc0.pdf; Height: 1mm; Manufacturer_Part_Number: CP2102-GM; Mouser Part Number: 634-CP2102-GM; Mouser Price/Stock: https://www.mouser.co.uk/ProductDetail/Silicon-Labs/CP2102-GM?qs=yHCtFi5ROqJvCcyR88R4Pg%3D%3D; Arrow Part Number: CP2102-GM; Arrow Price/Stock: https://www.arrow.com/en/products/cp2102-gm/silicon-labs?utm_currency=USD&region=europe